# Altium schematic sheet Can.SchDoc
size A3; Organization: Altium Limited; Address1: L3, 12a Rodborough Rd; Address2: Frenchs Forest; Address3: NSW; Address4: Australia 2086; SheetNumber: 2; SheetTotal: 4
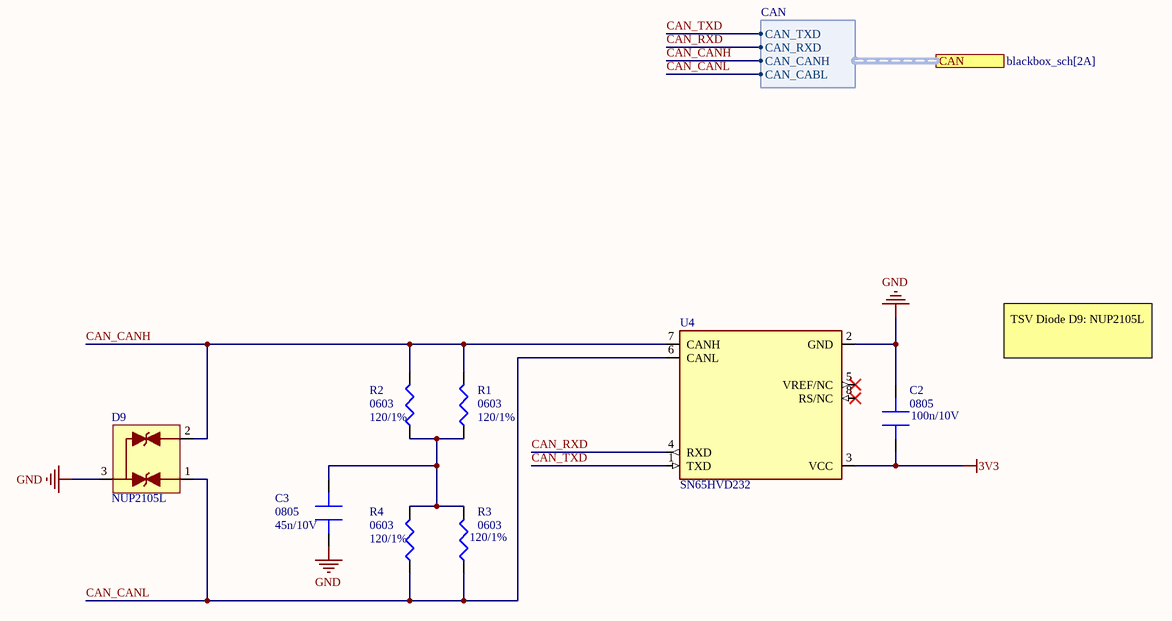
[diagram p0: Can.SchDoc]

## Parts
C2  value 100n/10V  Package: 0805  [CAPC2012X09L [0805]]  (hidden comment: C)
C3  value 45n/10V  Package: 0805  [CAPC2012X09L [0805]]  (hidden comment: C)
D9  NUP2105L  [SOT95P237X111-3N [SOT23]]
R1  value 120/1%  Package: 0603  [RESC1608X05L [0603]]  (hidden comment: R)
R2  value 120/1%  Package: 0603  [RESC1608X05L [0603]]  (hidden comment: R)
R3  value 120/1%  Package: 0603  [RESC1608X05L [0603]]  (hidden comment: R)
R4  value 120/1%  Package: 0603  [RESC1608X05L [0603]]  (hidden comment: R)
U4  PN: SN65HVD232  [SOIC127P600X175-8N]  (hidden comment: SN65HVD23x)

## Ports
CAN (harness CAN, see blackbox_sch[2A])

## Harnesses
CAN: CAN_TXD, CAN_RXD, CAN_CANH, CAN_CABL

## Nets
3V3: C2.1 U4.3(VCC)
GND: C2.2 C3.1 D9.3 U4.2(GND)
CAN_CANH: D9.2 R1.2 R2.1 U4.7(CANH) ; port CAN.CAN_CANH
CAN_CANL: D9.1 R3.1 R4.1 U4.6(CANL) ; port CAN.CAN_CABL
CAN_RXD: U4.4(RXD) ; port CAN.CAN_RXD
CAN_TXD: U4.1(TXD) ; port CAN.CAN_TXD
NetC3_2: C3.2 R1.1 R2.2 R3.2 R4.2

Not connected (* = marked no-connect by the designer): U4 5(VREF/NC)* 8(RS/NC)*

## Notes on the sheet
- TSV Diode D9: NUP2105L
- TITLE:
- PROJECT:
- FILE NAME:
- DRAWN BY:
- CHECKED BY:
- DATE:
- SHEET NO.:
- PROJ. REV.:
- OF
- SHEET REV.:
- SIZE:
- A3

## Library data of the parts
C2 C3 = C: Standard capacitor
D9 = NUP2105L: ESD protection diode - dual line CAN bus protector; HelpURL: https://www.onsemi.com/pub/Collateral/NUP2105L-D.PDF; PN: NUP2105L
R1-R4 = R: Standard resistor
U4 = SN65HVD23x: CAN bus transceiver, 3V3; HelpURL: https://www.ti.com/lit/ds/symlink/sn65hvd230.pdf